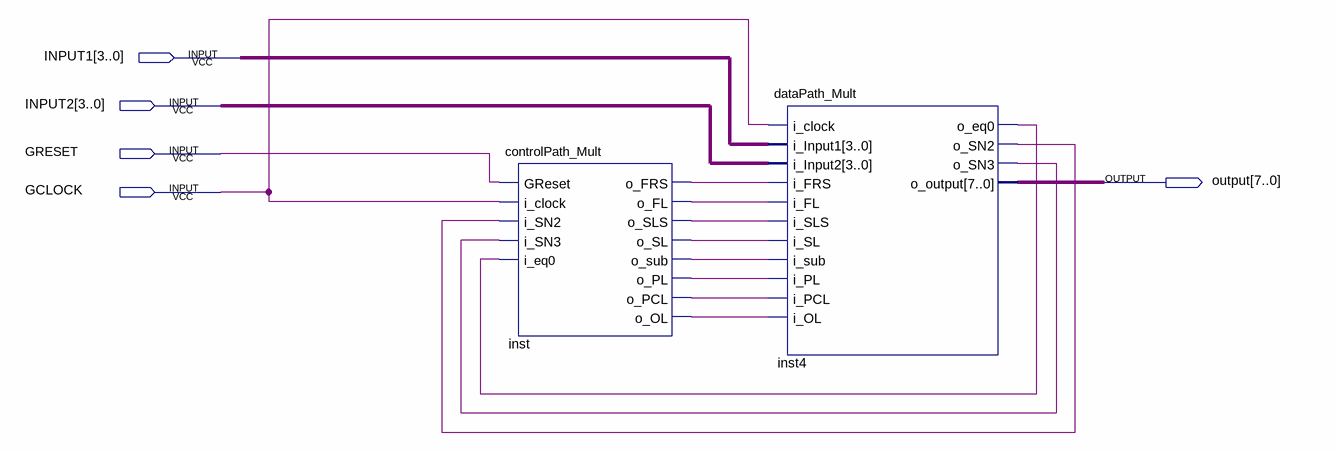
[diagram p0: schematic sheet]
// Quartus schematic topLevel_Mult.bdf as structural Verilog: 2 symbols, 5 pins
module topLevel_Mult (
  input  [3:0] INPUT1,
  input  [3:0] INPUT2,
  input  GRESET,
  input  GCLOCK,
  output [7:0] \output 
);

  wire inst4_o_eq0, inst4_o_sn2, inst4_o_sn3, inst_o_fl, inst_o_frs, inst_o_ol, inst_o_pcl, inst_o_pl,
       inst_o_sl, inst_o_sls, inst_o_sub;

  controlPath_Mult inst (
    .GReset(GRESET), .i_clock(GCLOCK), .i_SN2(inst4_o_sn2), .i_SN3(inst4_o_sn3), .i_eq0(inst4_o_eq0),
    .o_FRS(inst_o_frs), .o_FL(inst_o_fl), .o_SLS(inst_o_sls), .o_SL(inst_o_sl), .o_sub(inst_o_sub),
    .o_PL(inst_o_pl), .o_PCL(inst_o_pcl), .o_OL(inst_o_ol));
  dataPath_Mult inst4 (
    .i_clock(GCLOCK), .i_Input1(INPUT1), .i_Input2(INPUT2), .i_FRS(inst_o_frs), .i_FL(inst_o_fl),
    .i_SLS(inst_o_sls), .i_SL(inst_o_sl), .i_sub(inst_o_sub), .i_PL(inst_o_pl), .i_PCL(inst_o_pcl),
    .i_OL(inst_o_ol), .o_eq0(inst4_o_eq0), .o_SN2(inst4_o_sn2), .o_SN3(inst4_o_sn3), .o_output(\output ));
endmodule
